# EAGLE design usbswitch_july2016 (EAGLE 6.5.0)
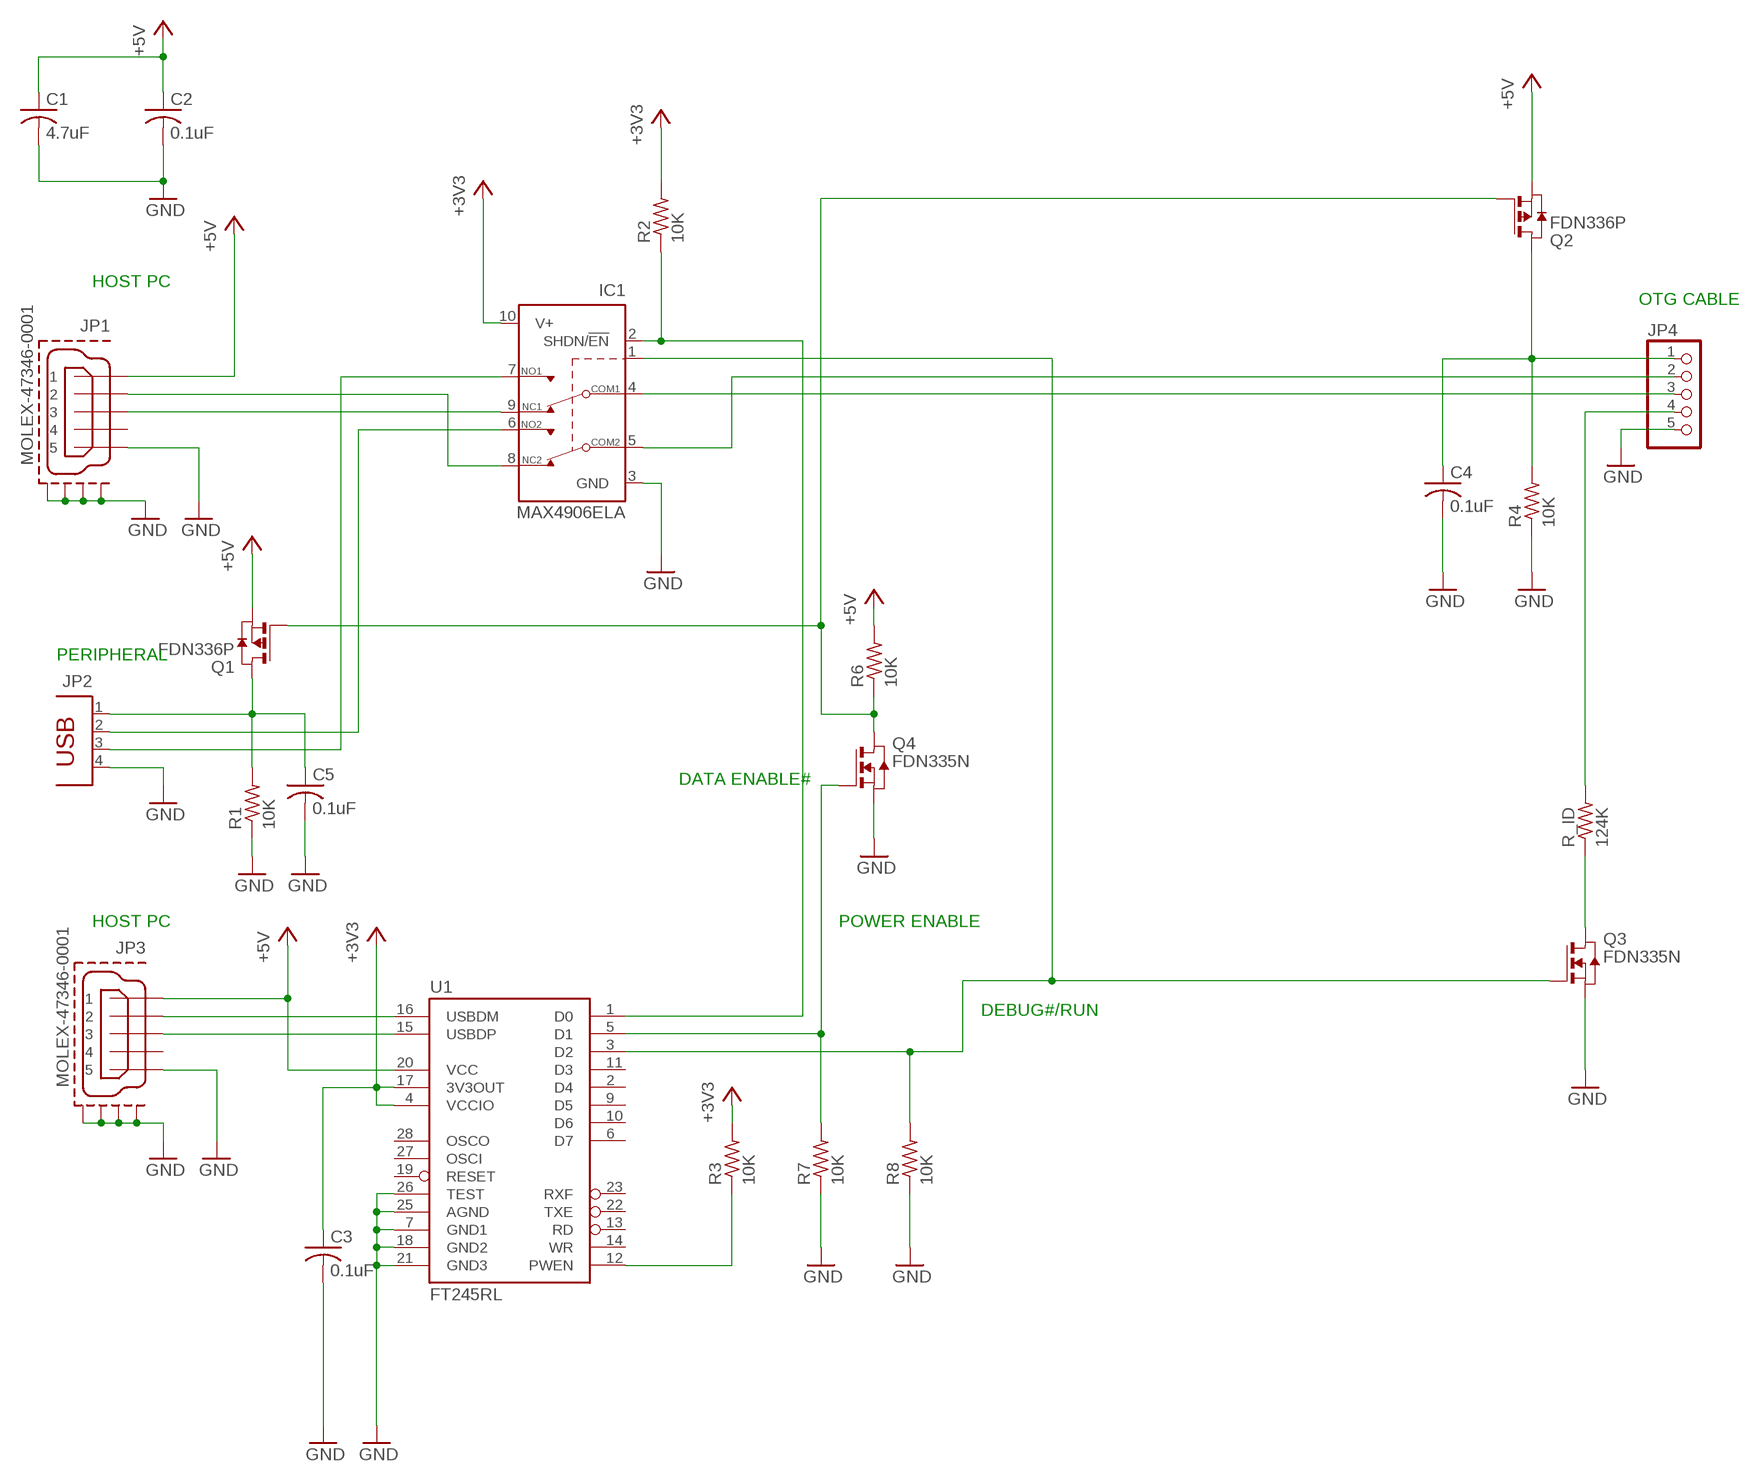
[diagram p0: schematic, sheet 1]

## Parts
C1  4.7uF  C-USC1210K  [C1210K]
C2  0.1uF  C-USC0805K  [C0805K]
C3  0.1uF  C-USC0805K  [C0805K]
C4  0.1uF  C-USC0805K  [C0805K]
C5  0.1uF  C-USC0805K  [C0805K]
IC1  MAX4906ELA  [UDFN10]
JP1  MOLEX-47346-0001  [MOLEX-47364-0001]
JP2  PN87520  [PN87520]
JP3  MOLEX-47346-0001  [MOLEX-47364-0001]
JP4  PINHD-1X5  [1X05]
Q1  FDN336P  PMOSSOT23  [SOT-23]
Q2  FDN336P  PMOSSOT23  [SOT-23]
Q3  FDN335N  NMOSSTO23  [SOT-23]
Q4  FDN335N  NMOSSTO23  [SOT-23]
R1  10K  R-US_R0805W  [R0805W]
R2  10K  R-US_R0805W  [R0805W]
R3  10K  R-US_R0805W  [R0805W]
R4  10K  R-US_R0805W  [R0805W]
R6  10K  R-US_R0805W  [R0805W]
R7  10K  R-US_R0805W  [R0805W]
R8  10K  R-US_R0805W  [R0805W]
R_ID  124K  R-US_R0805W  [R0805W]
U1  FT245RL  [SSOP28DB]

## Nets
+3V3: C3.1 IC1.10(V+) R2.2 R3.2 U1.4(VCCIO) U1.17(3V3OUT)
+5V: C1.1 C2.1 JP1.1 JP3.1 Q1.2(S) Q2.2(S) R6.2 U1.20(VCC)
GND: C1.2 C2.2 C3.2 C4.2 C5.2 IC1.3(GND) JP1.5 JP1.GND1 JP1.GND2 JP1.GND3 JP1.GND4 JP2.4 JP3.5 JP3.GND1 JP3.GND2 JP3.GND3 JP3.GND4 JP4.5 Q3.2(S) Q4.2(S) R1.1 R4.1 R7.1 R8.1 U1.7(GND1) U1.18(GND2) U1.21(GND3) U1.25(AGND) U1.26(TEST)
N$1: IC1.4(COM1) JP4.3
N$2: IC1.2(SHDN/!EN) R2.1 U1.1(D0)
N$3: C5.1 JP2.1 Q1.1(D) R1.2
N$4: C4.1 JP4.1 Q2.1(D) R4.2
N$5: IC1.9(NC1) JP1.3
N$6: IC1.8(NC2) JP1.2
N$7: Q3.1(D) R_ID.1
N$8: Q4.3(G) R7.2 U1.5(D1)
N$9: IC1.6(NO2) JP2.2
N$10: IC1.7(NO1) JP2.3
N$11: JP3.2 U1.16(USBDM)
N$13: IC1.1(IN) Q3.3(G) R8.2 U1.3(D2)
N$14: Q1.3(G) Q2.3(G) Q4.1(D) R6.1
N$15: R3.1 U1.12(PWEN)
N$17: JP4.4 R_ID.2
N$18: IC1.5(COM2) JP4.2
N$27: JP3.3 U1.15(USBDP)
Unconnected: JP1.4 JP3.4 U1.2(D4) U1.6(D7) U1.9(D5) U1.10(D6) U1.11(D3) U1.13(RD) U1.14(WR) U1.19(RESET) U1.22(TXE) U1.23(RXF) U1.27(OSCI) U1.28(OSCO)

## Notes on the sheet
- HOST PC
- OTG CABLE
- PERIPHERAL
- DATA ENABLE#
- HOST PC | POWER ENABLE
- DEBUG#/RUN

## Library data of the parts
C1-C5 = rcl:C-US: CAPACITOR, American symbol
IC1 = maxim:MAX4906: High-/Full-Speed USB 2.0 Switches Source: http://datasheets.maxim-ic.com/en/ds/MAX4906-MAX4907F.pdf; OC_FARNELL: unknown; OC_NEWARK: unknown
JP1 JP3 = usb_con-update:MOLEX-47346-0001: MICRO USB B, BOTTOM MOUNT
JP2 = con-berg:PN87520: BERG USB connector; OC_FARNELL: unknown; OC_NEWARK: unknown
JP4 = pinhead:PINHD-1X5: PIN HEADER
Q1 Q2 = zetex:PMOSSOT23: MOS FET; OC_FARNELL: unknown; OC_NEWARK: unknown
Q3 Q4 = zetex:NMOSSTO23: MOS FET
R1-R4 R6-R8 R_ID = rcl:R-US_: RESISTOR, American symbol
U1 = SparkFun-DigitalIC:FT245RL: USB FIFO Controller 4th Generation USB Controller (USB <-> Parallel) - FIFO. Spark Fun Electronics SKU : COM-00787

## Board
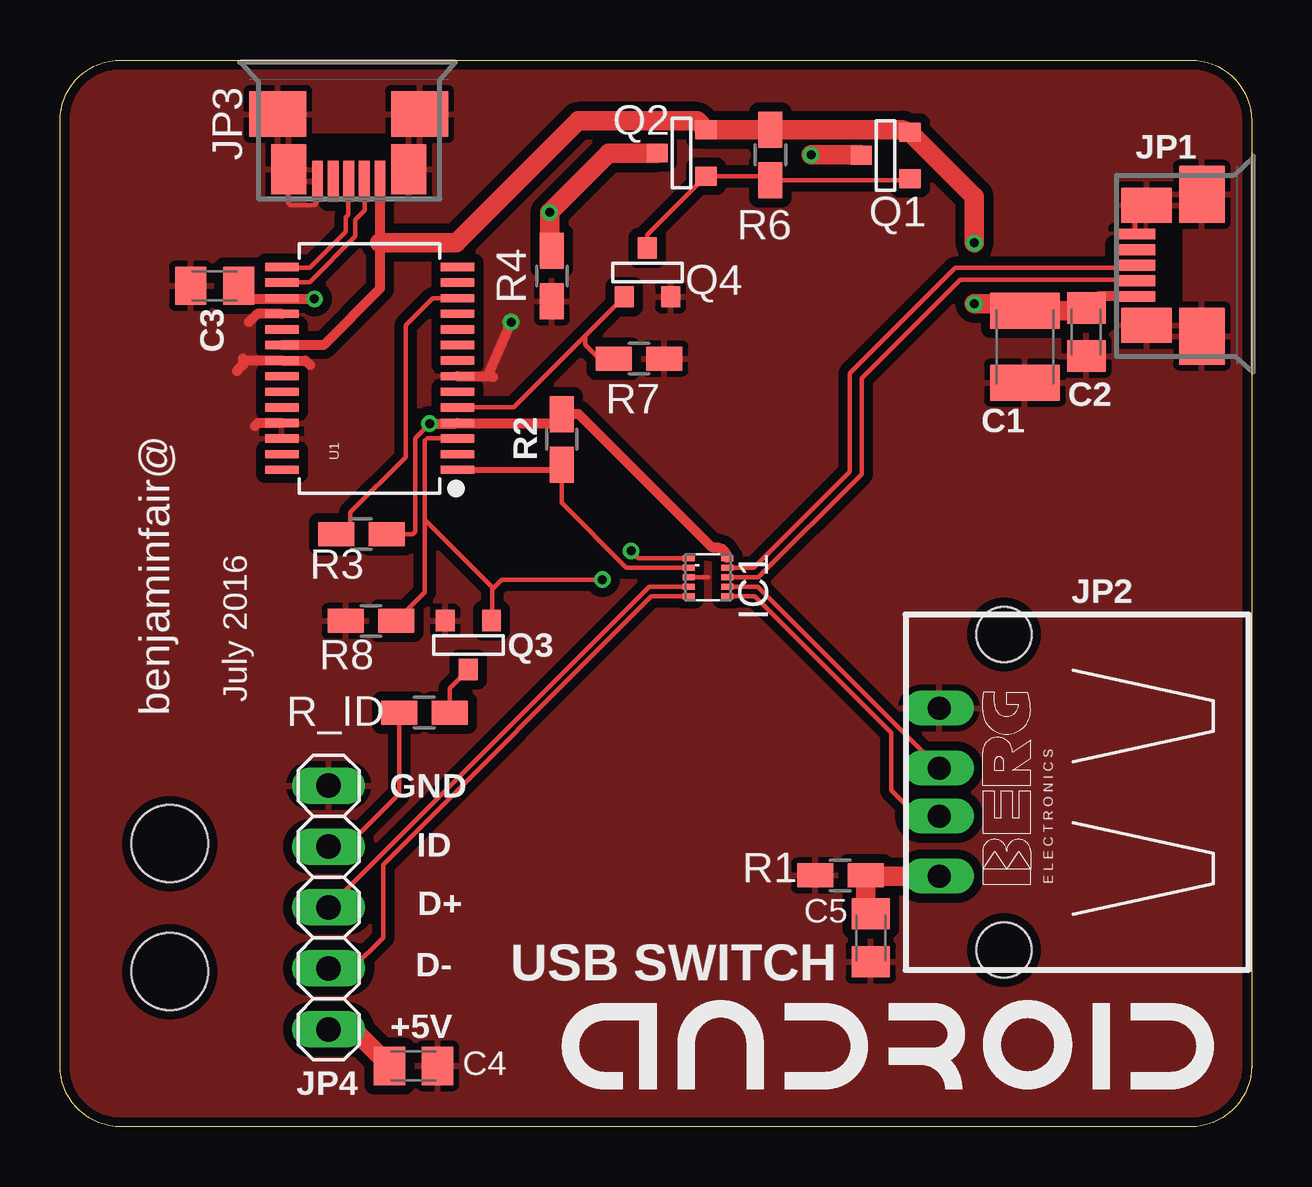
[diagram p1: board, top side]
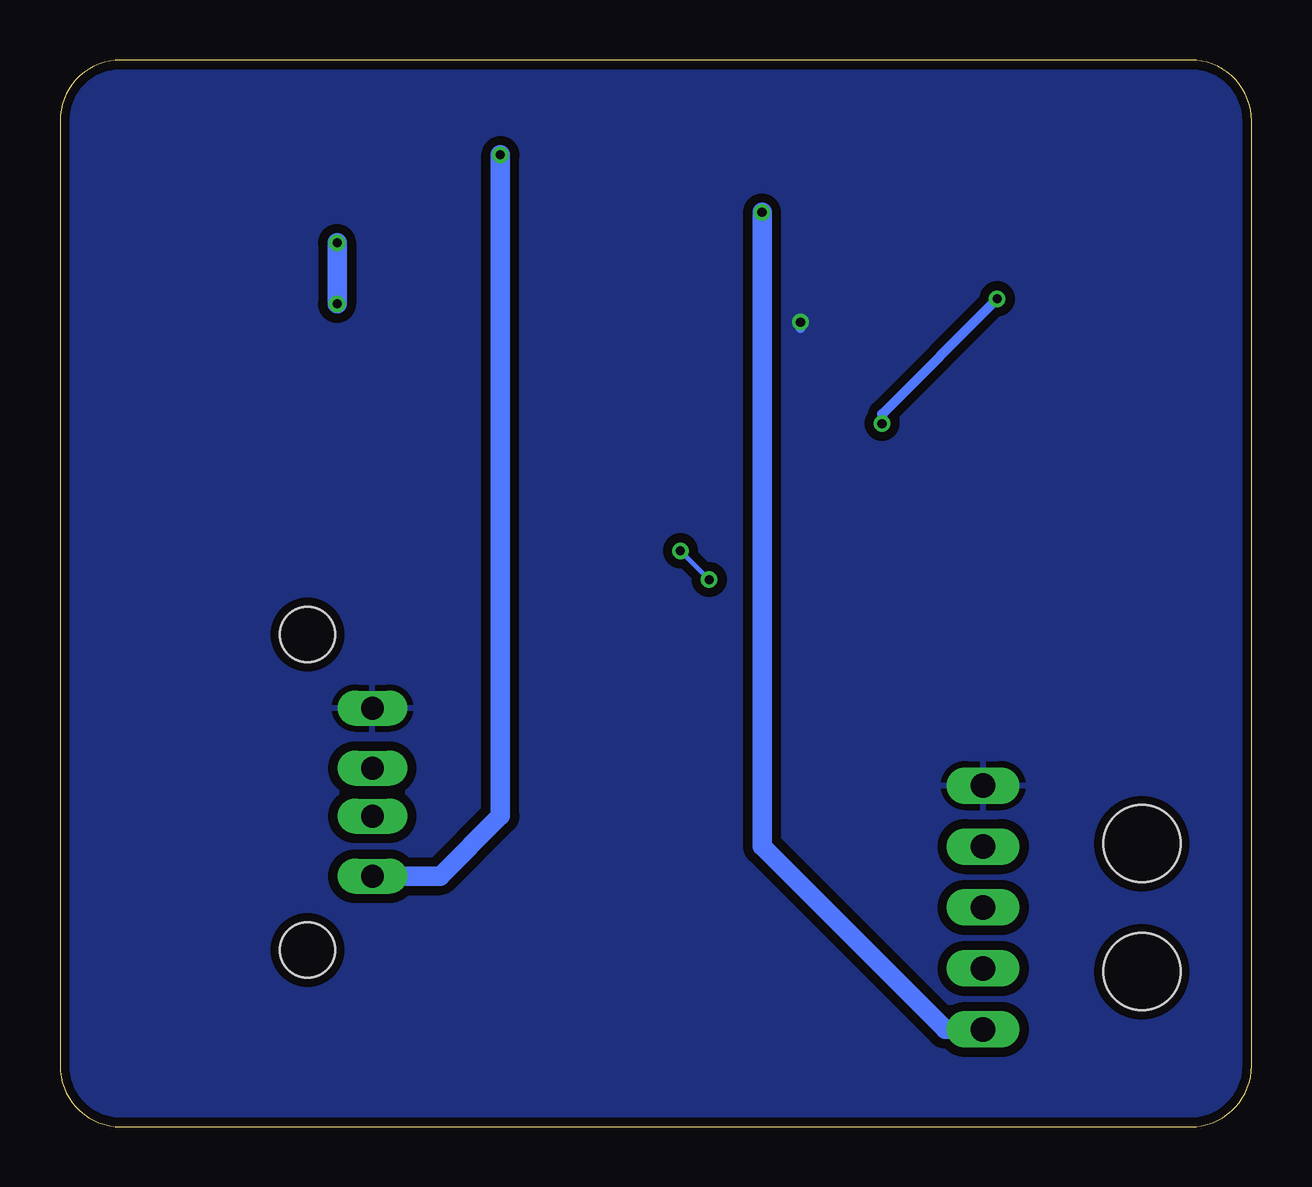
[diagram p2: board, bottom side, seen from below]

Size 49.65 x 44.45 mm. Coordinates in mm from the lower left corner, seen from the top.
Outline: 0,41.91 arc-90 2.54,44.45 47.11,44.45 arc-90 49.65,41.91 49.65,2.54 arc-90 47.11,0 2.54,0 arc-90 0,2.54 0,41.91
Copper layers (1*16): Top 0.035mm / dielectric 1.5mm / Bottom 0.035mm
Design rules "dirt_cheap_dirty_boards.v1": minimum track width 5mil, minimum drill 12mil, track to track 5mil, track to pad 5mil, pad to pad 5mil, via to via 5mil, smd to smd 0mil, copper to edge 10mil, drill to drill 10mil, minimum pad ring 10mil, minimum via ring 6mil, stop-mask expansion 2mil, vias tented up to drill 25mil, thermal gap 10mil
Holes 3.2 mm at 4.57,11.8 4.57,6.47

### Footprints (pad centres in the part's own frame; a part is rotated, then mirrored left to right if it is on the bottom)
C1210K = smd 1.5 x 2.9: 1 -1.5,0; 2 1.5,0
C0805K = smd 1.3 x 1.6: 1 -1,0; 2 1,0
UDFN10 = smd 0.25 x 0.5: 1 -0.8,-0.8; 2 -0.4,-0.8; 3 0,-0.8; 4 0.4,-0.8; 5 0.8,-0.8; 6 0.8,0.8; 7 0.4,0.8; 8 0,0.8; 9 -0.4,0.8; 10 -0.8,0.8
MOLEX-47364-0001 = smd 1.7 x 0.45: 1 2.8,1.3; 2 2.8,0.65; 3 2.8,0; 4 2.8,-0.65; 5 2.8,-1.3 | smd 1.9 x 2.375: GND1 0,2.95; GND4 0,-2.95 | smd 2.1 x 1.475: GND2 2.3,2.5; GND3 2.3,-2.5
PN87520 = drill 0.95 long: 1 -3.5,2.71; 2 -1,2.71; 3 1,2.71; 4 3.5,2.71 | hole 2.3: -6.57,0; 6.57,0
1X05 = drill 1.016 long: 1 -5.08,0; 2 -2.54,0; 3 0,0; 4 2.54,0; 5 5.08,0
SOT-23 = smd 0.787 x 0.889: 1 0.025,-1.016; 2 -0.94,1.016; 3 0.991,1.016
R0805W = smd 1.5 x 1: 1 -1.052,0; 2 1.052,0
SSOP28DB = smd 0.348 x 1.397: 1 -4.225,-3.656; 2 -3.575,-3.656; 3 -2.925,-3.656; 4 -2.275,-3.656; 5 -1.625,-3.656; 6 -0.975,-3.656; 7 -0.325,-3.656; 8 0.325,-3.656; 9 0.975,-3.656; 10 1.625,-3.656; 11 2.275,-3.656; 12 2.925,-3.656; 13 3.575,-3.656; 14 4.225,-3.656; 15 4.225,3.656; 16 3.575,3.656; 17 2.925,3.656; 18 2.275,3.656; 19 1.625,3.656; 20 0.975,3.656; 21 0.325,3.656; 22 -0.325,3.656; 23 -0.975,3.656; 24 -1.625,3.656; 25 -2.275,3.656; 26 -2.925,3.656; 27 -3.575,3.656; 28 -4.225,3.656

### Placement (x,y rotation side)
C1  40.21,32.51 270 top
C2  42.77,33.11 270 top
C3  6.44,35.04 180 top
C4  14.73,2.54 0 top
C5  33.78,7.87 270 top
IC1  27,22.9 270 top
JP1  47.58,35.9 180 top
JP2  39.34,13.94 90 top
JP3  12.03,42.2 270 top
JP4  11.19,9.14 90 top
Q1  34.4,40.5 270 top
Q2  25.9,40.6 270 top
Q3  16.99,20.07 0 top
Q4  24.5,35.6 180 top
R1  32.51,10.47 0 top
R2  20.91,28.65 90 top
R3  12.55,24.7 0 top
R4  20.49,35.45 90 top
R6  29.6,40.5 90 top
R7  24.13,32 180 top
R8  12.95,21.08 0 top
R_ID  15.18,17.25 180 top
U1  12.9,31.6 90 top
U$1  [ANDROID_MARK_25]  20.91,1.57 0 top

### Tracks (layer width: path | path; a pad name or v marks a point on that pad's centre or on a via)
+3V3  (via drill 0.38)
  Top 0.178: 9.2,34.5 U1.17 9.3,34.5 | 7.5,34.5 C3.1 | v15.4,29.3 14.8,28.7 14.8,24.8 14.7,24.7 R3.2 | 16.5,29.3 U1.4
  Top 0.406: 7.5,34.5 9.2,34.5 | v15.4,29.3 16.5,29.3 | 9.3,34.5 v10.6,34.5 | U1.4 20.53,29.32 R2.2 21.61,29.7 27.18,24.13 27.37,24.13 arc-90 IC1.10
  Bottom 0.406: v10.6,34.5 15.4,29.7 v15.4,29.3
+5V  (via drill 0.38)
  Top 0.178: 9.3,32.6 U1.20
  Top 0.406: JP3.1 13.33,36.83 13.33,34.92 10.98,32.58 U1.20 | JP1.1 43.25,34.6 C2.1
  Top 0.813: 13.33,36.83 16.51,36.83 21.59,41.91 26.55,41.91 Q2.2 29.59,41.54 R6.2 35.1,41.55 Q1.2 38.1,38.76 v38.1,36.83 | v38.1,34.29 39.92,34.29 C1.1 42.66,34.01 C2.1
  Bottom 0.813: v38.1,36.83 v38.1,34.29
GND  (via drill 0.38 pad 0.61)
  Top 0.178: JP1.GND3 44.8,38.4 44.8,37.2 JP1.5 | JP3.5 10.7,39.4 10.7,38.5 10.6,38.4 9.6,38.4 9.5,38.5 9.5,39.9 JP3.GND3 | IC1.3 27,22.9
  Top 0.406: 7.37,31.5 7.62,31.75 7.62,32 7.7,31.93 U1.21 10.24,31.93 10.41,31.75 | U1.25 8.24,29.32 8.13,29.21 | 18.03,31.24 18,31.27 U1.7 17.81,31.27 v18.8,33.53 | U1.18 8.22,33.88 7.87,33.53
  Bottom 0.406: v18.8,33.53 18.8,33.27
  pour Top (isolate 0.381): 0,44.45 49.65,44.45 49.65,0 0,0
  pour Bottom (isolate 0.381): 0,0 0,44.45 49.65,44.45 49.65,0
N$1
  Top 0.178: JP4.3 24.55,22.5 IC1.4
N$2
  Top 0.178: IC1.2 23.6,23.3 20.9,26 20.9,27.5 R2.1
  Top 0.254: U1.1 20.69,27.38 R2.1
N$3  (via drill 0.38)
  Top 0.813: Q1.1 33.36,40.5 v31.3,40.5 | JP2.1 33.6,10.44 R1.2 33.56,9.09 C5.1
  Bottom 0.813: v31.3,40.5 31.3,12.95 33.81,10.44 JP2.1
N$4  (via drill 0.38)
  Top 0.813: Q2.1 22.88,40.58 v20.4,38.1 20.4,36.59 R4.2 | C4.1 12.21,4.06 JP4.1
  Bottom 0.813: v20.4,38.1 20.4,11.68 12.77,4.06 JP4.1
N$5
  Top 0.178: IC1.9 28.9,23.3 32.9,27.3 32.9,31.4 37.3,35.8 44.48,35.8
  Top 0.254: 44.48,35.8 JP1.3
N$6
  Top 0.178: IC1.8 29.1,22.9 33.4,27.2 33.4,31.2 37.5,35.3 44.73,35.3
  Top 0.254: 44.73,35.3 JP1.2
N$7
  Top 0.178: Q3.1 16.23,18.27 R_ID.1
N$8
  Top 0.178: U1.5 18.9,29.98 21.89,32.97 | 21.89,32.97 Q4.3 | R7.2 22.77,31.7 21.89,32.58 21.89,32.97
N$9
  Top 0.178: JP2.2 35.73,12.94 34.65,14.02 34.65,16.41 28.96,22.1 IC1.6
N$10
  Top 0.178: JP2.3 29.07,22.5 IC1.7
N$11
  Top 0.178: U1.16 9.3,35.2 10.4,35.2 12.3,37.1 12.3,37.8 12.7,38.2 12.7,39.4 JP3.2
N$13  (via drill 0.38)
  Top 0.178: IC1.1 24.1,23.7 v23.8,24 | v22.6,22.8 18.4,22.8 18.05,22.45 | 18.05,22.45 18,22.4 18,21.1 Q3.3 | 15.2,25.3 15.2,25.4 15.2,28.6 15.3,28.7 16.5,28.7 U1.3 | 18.05,22.45 15.2,25.3 | R8.2 15.2,22.28 15.2,25.3
  Bottom 0.178: v22.6,22.8 v23.8,24
N$14
  Top 0.178: Q1.3 35.28,39.45 R6.1 29.44,39.61 Q2.3 24.48,37.17 Q4.1
N$15
  Top 0.178: R3.1 12,24.7 12.1,24.8 12.1,25.6 14.4,27.9 14.4,33.4 15.53,34.52 U1.12 16.5,34.5
  Top 0.254: 16.53,34.5 U1.12
N$17
  Top 0.178: R_ID.2 14.13,13.87 11.93,11.68 JP4.4
N$18
  Top 0.178: JP4.2 12.19,6.6 13.46,7.87 13.46,10.92 24.64,22.1 IC1.5
N$27
  Top 0.178: U1.15 9.3,35.8 10.4,35.8 11.9,37.3 11.9,37.9 12,38 12,39.4 JP3.3

### Text on the board
tNames: benjaminfair@ | July 2016 | GND | ID | D+ | D- | USB SWITCH | +5V